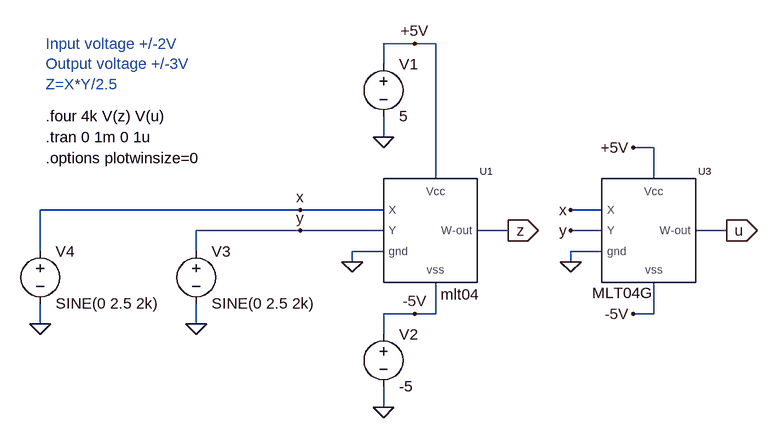
[diagram p0: schematic MLT04_test.asc]
MLT04_test.asc, the LTspice schematic file:
Version 4
SHEET 1 880 680
WIRE 128 -80 80 -80
WIRE 160 -80 128 -80
WIRE 80 -48 80 -80
WIRE 80 64 80 32
WIRE 496 80 464 80
WIRE 160 128 160 -80
WIRE 496 128 496 80
WIRE -48 176 -448 176
WIRE 80 176 -48 176
WIRE 416 176 368 176
WIRE -48 208 -208 208
WIRE 80 208 -48 208
WIRE 272 208 224 208
WIRE 416 208 368 208
WIRE 608 208 560 208
WIRE -448 240 -448 176
WIRE -208 240 -208 208
WIRE 80 240 32 240
WIRE 416 240 368 240
WIRE 32 256 32 240
WIRE 368 256 368 240
WIRE 128 336 80 336
WIRE 160 336 160 288
WIRE 160 336 128 336
WIRE 496 336 496 288
WIRE 496 336 464 336
WIRE -448 352 -448 320
WIRE -208 352 -208 320
WIRE 80 368 80 336
WIRE 80 480 80 448
FLAG 80 64 0
FLAG 80 480 0
FLAG -208 352 0
FLAG -448 352 0
FLAG 32 256 0
FLAG 272 208 z
IOPIN 272 208 Out
FLAG -48 176 x
FLAG -48 208 y
FLAG 128 -80 +5V
FLAG 128 336 -5V
FLAG 368 256 0
FLAG 608 208 u
IOPIN 608 208 Out
FLAG 464 336 -5V
FLAG 368 176 x
FLAG 368 208 y
FLAG 464 80 +5V
SYMBOL voltage 80 -64 R0
SYMATTR InstName V1
SYMATTR Value 5
SYMBOL voltage 80 352 R0
SYMATTR InstName V2
SYMATTR Value -5
SYMBOL voltage -208 224 R0
WINDOW 123 0 0 Left 0
WINDOW 39 0 0 Left 0
SYMATTR InstName V3
SYMATTR Value SINE(0 2.5 2k)
SYMBOL voltage -448 224 R0
WINDOW 123 0 0 Left 0
WINDOW 39 0 0 Left 0
SYMATTR InstName V4
SYMATTR Value SINE(0 2.5 2k)
SYMBOL mlt04 160 224 R0
WINDOW 38 8 82 Left 0
SYMATTR InstName U1
SYMBOL mlt04 496 224 R0
WINDOW 38 -95 80 Left 0
SYMATTR InstName U3
SYMATTR SpiceModel MLT04G
TEXT -440 64 Left 0 !.tran 0 1m 0 1u
TEXT -440 96 Left 0 !.options plotwinsize=0
TEXT -440 -80 Left 0 ;Input voltage +/-2V\nOutput voltage +/-3V\nZ=X*Y/2.5
TEXT -440 32 Left 0 !.four 4k V(z) V(u)

The netlist it stands for:
* MLT04_test.asc
V1 +5V 0 5
V2 -5V 0 -5
V3 y 0 SINE(0 2.5 2k)
V4 x 0 SINE(0 2.5 2k)
XU1 x y 0 z +5V -5V mlt04  ; pins X Y gnd W-out Vcc vss
XU3 x y 0 u +5V -5V MLT04G  ; pins X Y gnd W-out Vcc vss
.tran 0 1m 0 1u
.options plotwinsize=0
* Input voltage +/-2V
* Output voltage +/-3V
* Z=X*Y/2.5
.four 4k V(z) V(u)
.lib mult04.lib
.backanno
.end